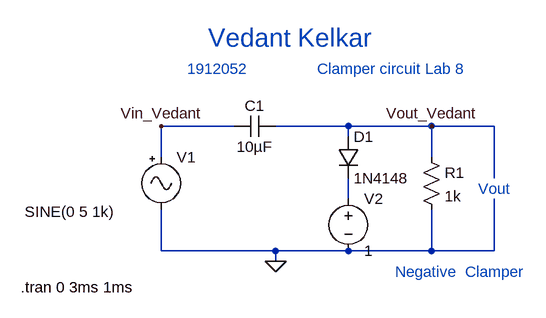
[diagram p0: schematic Draft21.asc]
Draft21.asc, the LTspice schematic file:
Version 4
SHEET 1 880 680
WIRE 112 208 0 208
WIRE 288 208 176 208
WIRE 416 208 288 208
WIRE 512 208 416 208
WIRE 288 224 288 208
WIRE 0 256 0 208
WIRE 416 256 416 208
WIRE 512 288 512 208
WIRE 288 320 288 288
WIRE 0 400 0 336
WIRE 176 400 0 400
WIRE 288 400 176 400
WIRE 416 400 416 336
WIRE 416 400 288 400
WIRE 512 400 512 320
WIRE 512 400 416 400
WIRE 176 416 176 400
FLAG 176 416 0
FLAG 0 208 Vin_Vedant
FLAG 416 208 Vout_Vedant
SYMBOL Misc\\signal 0 240 R0
WINDOW 3 -210 100 Left 2
WINDOW 123 0 0 Left 0
WINDOW 39 0 0 Left 0
SYMATTR Value SINE(0 5 1k)
SYMATTR InstName V1
SYMBOL cap 176 192 R90
WINDOW 0 0 32 VBottom 2
WINDOW 3 32 32 VTop 2
SYMATTR InstName C1
SYMATTR Value 10µF
SYMBOL diode 272 224 R0
SYMATTR InstName D1
SYMATTR Value 1N4148
SYMBOL res 400 240 R0
SYMATTR InstName R1
SYMATTR Value 1k
SYMBOL voltage 288 304 R0
WINDOW 123 0 0 Left 0
WINDOW 39 0 0 Left 0
SYMATTR InstName V2
SYMATTR Value 1
TEXT 72 72 Left 4 ;Vedant Kelkar
TEXT 40 120 Left 2 ;1912052
TEXT 240 120 Left 2 ;Clamper circuit Lab 8
TEXT 488 304 Left 2 ;Vout
TEXT 360 432 Left 2 ;Negative  Clamper
TEXT -216 456 Left 2 !.tran 0 3ms 1ms

The netlist it stands for:
* Draft21.asc
V1 Vin_Vedant 0 SINE(0 5 1k)
C1 Vout_Vedant Vin_Vedant 10µF
D1 Vout_Vedant N001 1N4148
R1 Vout_Vedant 0 1k
V2 N001 0 1
.model D D
.lib standard.dio
* Vedant Kelkar
* 1912052
* Clamper circuit Lab 8
* Vout
* Negative  Clamper
.tran 0 3ms 1ms
.backanno
.end